# EAGLE design remote_smt (EAGLE 6.1)
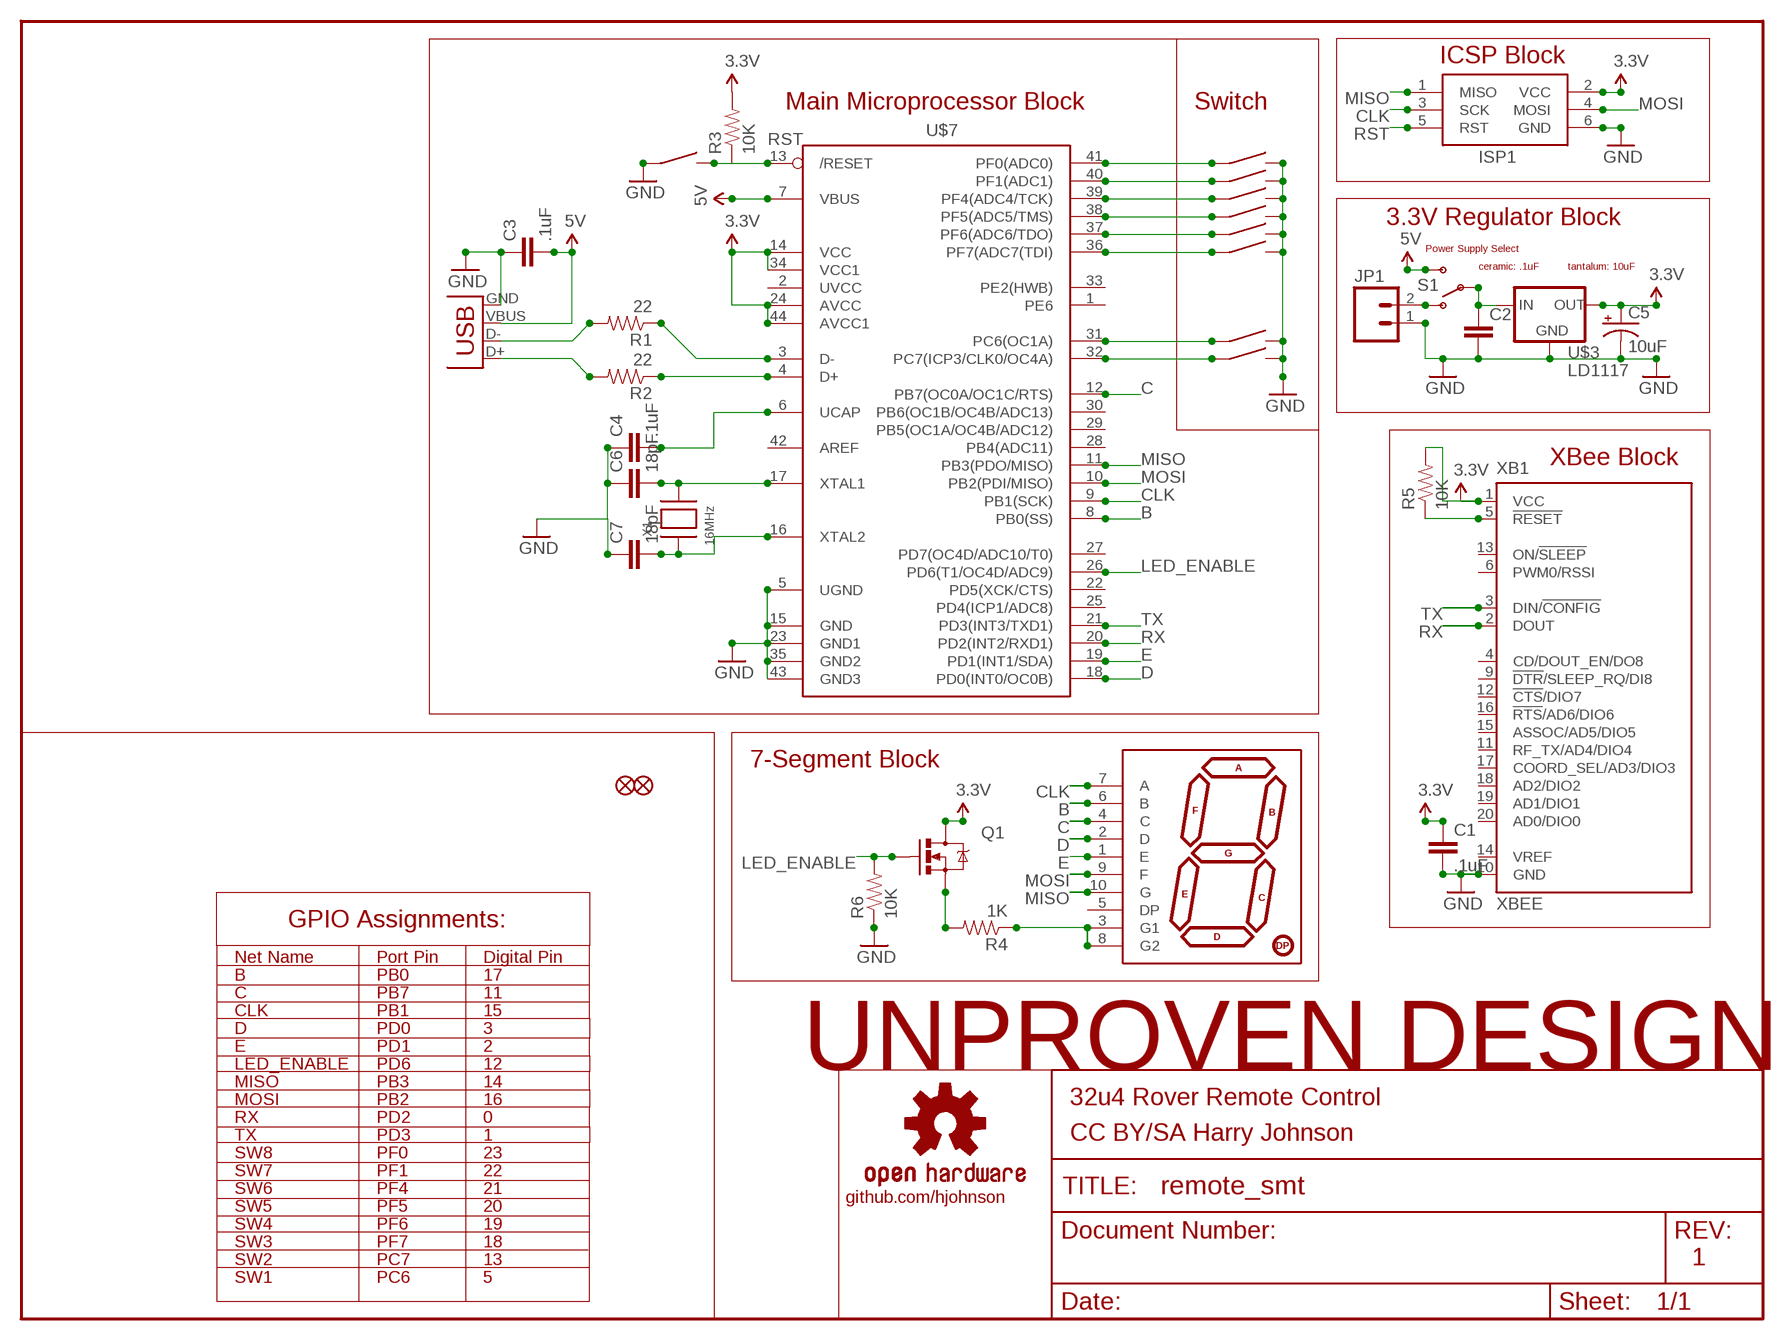
[diagram p0: schematic, sheet 1]

## Parts
C1  .1uF  CAP0805  [0805]
C2  CAP0805  [0805]
C3  .1uF  CAP0805  [0805]
C4  .1uF  CAP0805  [0805]
C5  10uF  CAP_POL3528-KIT  [EIA3528-KIT]
C6  18pF  CAP0805  [0805]
C7  18pF  CAP0805  [0805]
ISP1  AVRISP-6  [AVRISP]
JP1  M023.5MM  [SCREWTERMINAL-3.5MM-2]
JP2  FIDUCIAL1.5X3  [FIDUCIAL-1.5X3]
JP3  FIDUCIAL1.5X3  [FIDUCIAL-1.5X3]
Q1  MOSFET-NCHANNELSMD  [SOT23-3]
R1  22  RESISTOR0805-RES  [0805]
R2  22  RESISTOR0805-RES  [0805]
R3  10K  RESISTOR0805-RES  [0805]
R4  1K  RESISTOR0805-RES  [0805]
R5  10K  RESISTOR0805-RES  [0805]
R6  10K  RESISTOR0805-RES  [0805]
S1  SWITCH-SPSTKIT  [SWITCH-SPDT_KIT]
U$1  7-SEGMENT-DISPLAY-1"-RED  [7-SEGMENT-1"PTH]
U$2  SPST_SWITCH  [EG2513-ND]
U$3  LD1117  V_REG_LD1117VXXSOT223  [SOT223]
U$6  SPST_SWITCH  [EG2513-ND]
U$7  ATMEGA32U4-AU  [TQFP44]
U$8  SPST_SWITCH  [EG2513-ND]
U$10  OSHW-LOGOL  [OSHW-LOGO-L]
U$11  SPST_SWITCH  [EG2513-ND]
U$12  SPST_SWITCH  [EG2513-ND]
U$13  SPST_SWITCH  [EG2513-ND]
U$14  SPST_SWITCH  [EG2513-ND]
U$15  SPST_SWITCH  [EG2513-ND]
U$17  SPST_SWITCH  [EG2513-ND]
X1  16MHz  XTALNX5032  [NX5032]
X2  USBPTH  [USB-B-PTH]
XB1  XBEE  [XBEE]

## Nets
3.3V: C1.1 C5.A(+) ISP1.2(VCC) Q1.3(D) R3.2 R5.2 U$3.2(OUT) U$7.14(VCC) U$7.24(AVCC) U$7.34(VCC1) U$7.44(AVCC1) XB1.1(VCC)
5V: C3.2 S1.3(S) U$7.7(VBUS) X2.VBUS
B: U$1.6(B) U$7.8(PB0(SS))
C: U$1.4(C) U$7.12(PB7(OC0A/OC1C/RTS))
CLK: ISP1.3(SCK) U$1.7(A) U$7.9(PB1(SCK))
D: U$1.2(D) U$7.18(PD0(INT0/OC0B))
E: U$1.1(E) U$7.19(PD1(INT1/SDA))
GND: C1.2 C2.2 C3.1 C4.1 C5.C(-) C6.1 C7.1 ISP1.6(GND) JP1.1 R6.1 U$2.P$1 U$3.1(GND) U$3.4(GND) U$6.P$2 U$7.5(UGND) U$7.15(GND) U$7.23(GND1) U$7.35(GND2) U$7.43(GND3) U$8.P$2 U$11.P$2 U$12.P$2 U$13.P$2 U$14.P$2 U$15.P$2 U$17.P$2 X2.GND XB1.10(GND)
LED_ENABLE: Q1.1(G) R6.2 U$7.26(PD6(T1/OC4D/ADC9))
MISO: ISP1.1(MISO) U$1.10(G) U$7.11(PB3(PDO/MISO))
MOSI: ISP1.4(MOSI) U$1.9(F) U$7.10(PB2(PDI/MISO))
N$1: C6.2 U$7.17(XTAL1) X1.P$2
N$2: C7.2 U$7.16(XTAL2) X1.P$1
N$3: R1.1 U$7.3(D-)
N$4: R2.1 U$7.4(D+)
N$5: R2.2 X2.D+
N$6: R1.2 X2.D-
N$7: R4.1 U$1.3(G1) U$1.8(G2)
N$9: C4.2 U$7.6(UCAP)
N$10: Q1.2(S) R4.2
N$20: JP1.2 S1.1(O)
N$21: C2.1 S1.2(P) U$3.3(IN)
RST: ISP1.5(RST) R3.1 U$2.P$2 U$7.13(/RESET)
RX: U$7.20(PD2(INT2/RXD1)) XB1.2(DOUT)
SW1: U$6.P$1 U$7.31(PC6(OC1A))
SW2: U$7.32(PC7(ICP3/CLK0/OC4A)) U$8.P$1
SW3: U$7.36(PF7(ADC7(TDI)) U$17.P$1
SW4: U$7.37(PF6(ADC6/TDO)) U$15.P$1
SW5: U$7.38(PF5(ADC5/TMS)) U$14.P$1
SW6: U$7.39(PF4(ADC4/TCK)) U$13.P$1
SW7: U$7.40(PF1(ADC1)) U$12.P$1
SW8: U$7.41(PF0(ADC0)) U$11.P$1
TX: U$7.21(PD3(INT3/TXD1)) XB1.3(DIN/!CONFIG)
XBEE_RST: R5.1 XB1.5(!RESET)
Unconnected: U$1.5(DP) U$7.1(PE6) U$7.2(UVCC) U$7.22(PD5(XCK/CTS)) U$7.25(PD4(ICP1/ADC8)) U$7.27(PD7(OC4D/ADC10/T0)) U$7.28(PB4(ADC11)) U$7.29(PB5(OC1A/OC4B/ADC12)) U$7.30(PB6(OC1B/OC4B/ADC13)) U$7.33(PE2(HWB)) U$7.42(AREF) XB1.4(CD/DOUT_EN/DO8) XB1.6(PWM0/RSSI) XB1.9(!DTR!/SLEEP_RQ/DI8) XB1.11(RF_TX/AD4/DIO4) XB1.12(!CTS!/DIO7) XB1.13(ON/!SLEEP) XB1.14(VREF) XB1.15(ASSOC/AD5/DIO5) XB1.16(!RTS!/AD6/DIO6) XB1.17(COORD_SEL/AD3/DIO3) XB1.18(AD2/DIO2) XB1.19(AD1/DIO1) XB1.20(AD0/DIO0)

## Notes on the sheet
- ICSP Block
- Main Microprocessor Block | Switch
- 3.3V Regulator Block
- Power Supply Select
- ceramic: .1uF | tantalum: 10uF
- XBee Block
- 7-Segment Block
- GPIO Assignments:
- Net Name | Port Pin | Digital Pin
- B | PB0 | 17
- C | PB7 | 11
- CLK | PB1 | 15
- D | PD0 | 3
- E | PD1 | 2
- LED_ENABLE | PD6 | 12 | UNPROVEN DESIGN
- MISO | PB3 | 14
- MOSI | PB2 | 16 | 32u4 Rover Remote Control
- RX | PD2 | 0
- TX | PD3 | 1 | CC BY/SA Harry Johnson
- SW8 | PF0 | 23
- SW7 | PF1 | 22
- SW6 | PF4 | 21
- github.com/hjohnson
- SW5 | PF5 | 20
- SW4 | PF6 | 19
- SW3 | PF7 | 18
- SW2 | PC7 | 13 | 1
- SW1 | PC6 | 5

## Library data of the parts
C1-C4 C6 C7 = SparkFun:CAP: Capacitor Standard 0603 ceramic capacitor, and 0.1" leaded capacitor.
C5 = SparkFun:CAP_POL: Capacitor Polarized These are standard SMD and PTH capacitors. Normally 10uF, 47uF, and 100uF in electrolytic and tantalum varieties. Always verify the external diameter of the through hole cap, it varies with capacity, voltage, and manufacturer. The EIA devices should be standard.
ISP1 = adafruit:AVRISP: AVR ISP HEADER Standard 6 pin header for AVR programming
JP1 = SparkFun:M02: Header 2 Standard 2-pin 0.1" header. Use with straight break away headers (SKU : PRT-00116), right angle break away headers (PRT-00553), swiss pins (PRT-00743), machine pins (PRT-00117), and female headers (PRT-00115). Molex polarized connector foot print use with SKU : PRT-08233 with associated crimp pins and housings.
JP2 JP3 = SparkFun:FIDUCIAL: Fiducial Alignment Points Various fiducial points for machine vision alignment.
Q1 = SparkFun:MOSFET-NCHANNEL
R1-R6 = SparkFun:RESISTOR: Resistor Basic schematic elements and footprints for 0603, 1206, and PTH resistors.
S1 = SparkFun:SWITCH-SPST: SPST Switch Simple slide switch. Spark Fun Electronics SKU : COM-00102
U$1 = SparkFun:7-SEGMENT-DISPLAY-1"-RED: 7-Segment Display 1" Red (COM-08546)
U$2 U$6 U$8 U$11-U$15 U$17 = hjohnson_library:SPST_SWITCH
U$3 = hjohnson_library:V_REG_LD1117VXX: LD1117VXX voltage regulator. We carry the 3.3V version (COM-00526) in TO-220 package.
U$7 = adafruit:ATMEGA32U4: http://www.ladyada.net/library/eagle
U$10 = SparkFun:OSHW-LOGO: Open Source Hardware Logo This logo indicates the piece of hardware it is found on incorporates a OSHW license and/or adheres to the definition of open source hardware found here: http://freedomdefined.org/OSHW
X1 = adafruit:XTAL: Low cost SMT crystals, no capacitors included http://www.ladyada.net/library/eagle
X2 = hjohnson_library:USB: USB Connectors USB-B-PTH is fully proven SKU : PRT-00139 USB-miniB is fully proven SKU : PRT-00587 USB-A-PCB is untested. USB-A-H is throughly reviewed, but untested. Spark Fun Electronics SKU : PRT-00437 USB-B-SMT is throughly reviewed, but untested. Needs silkscreen touching up. USB-A-S has not been used/tested USB-MB-H has not been used/tested
XB1 = maxstream:XBEE: XBee (TM) /XBee-PRO(TM) OEM RF Modules Source: MaxStream, Inc. xbee_productmanual.pdf

## Board
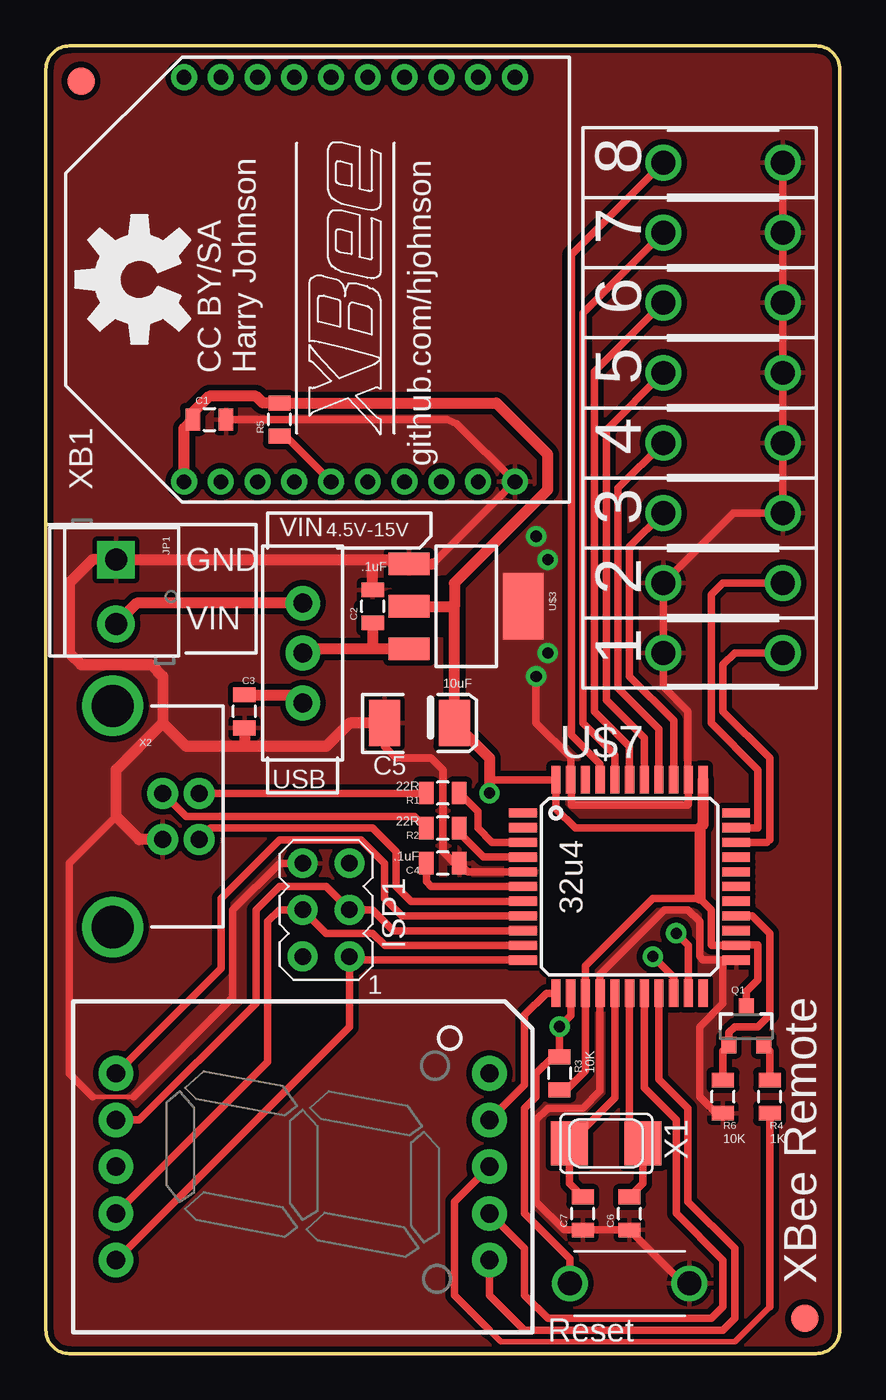
[diagram p1: board, top side]
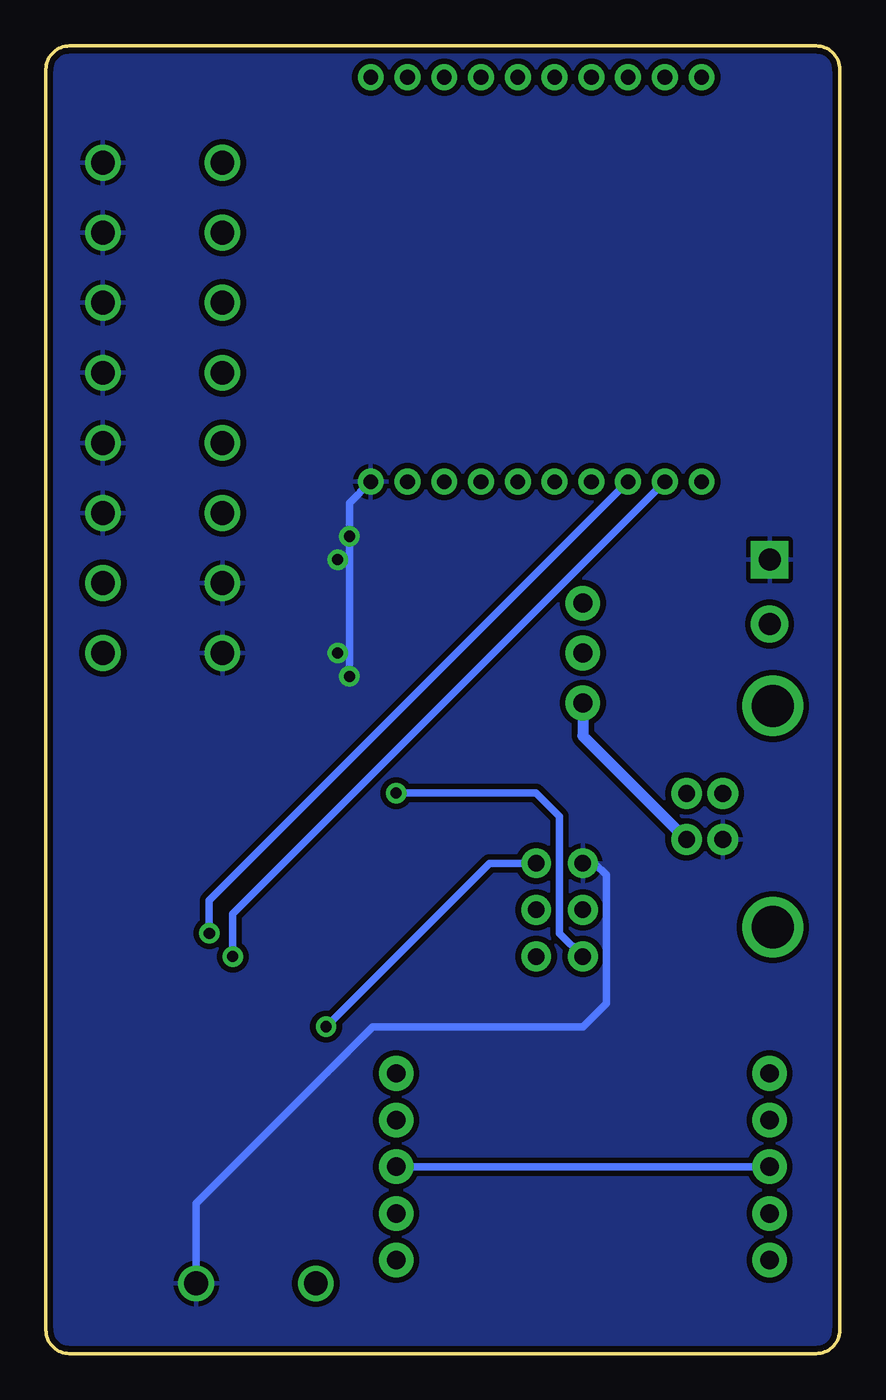
[diagram p2: board, bottom side, seen from below]

Size 43.18 x 71.12 mm. Coordinates in mm from the lower left corner, seen from the top.
Outline: 1.27,0 41.91,0 arc90 43.18,1.27 43.18,69.85 arc90 41.91,71.12 1.27,71.12 arc90 0,69.85 0,1.27 arc90 1.27,0
Copper layers (1*16): Top 0.035mm / dielectric 1.5mm / Bottom 0.035mm
Design rules: minimum track width 8mil, minimum drill 20mil, track to track 8mil, track to pad 8mil, pad to pad 8mil, via to via 8mil, smd to smd 8mil, copper to edge 10mil, drill to drill 8mil, minimum pad ring 12mil, minimum via ring 10mil, stop-mask expansion 4mil, vias tented up to drill 25mil, thermal gap 10mil
tRestrict: 4 lines

### Footprints (pad centres in the part's own frame; a part is rotated, then mirrored left to right if it is on the bottom)
0805 = smd 0.8 x 1.2: 1 -0.9,0; 2 0.9,0
EIA3528-KIT = smd 1.7 x 2.5: A 1.9,0; C -1.9,0
AVRISP = drill 0.9 pad 1.626: 1 -1.27,2.54; 2 1.27,2.54; 3 -1.27,0; 4 1.27,0; 5 -1.27,-2.54; 6 1.27,-2.54
SCREWTERMINAL-3.5MM-2 = drill 1.2 pad 2.032 square: 1 0,0 | drill 1.2 pad 2.032: 2 3.5,0
FIDUCIAL-1.5X3 = smd 1.5 x 1.5: 1 0,0
SOT23-3 = smd 0.8 x 0.9: 1 -0.95,-1; 2 0.95,-1; 3 0,1.1
SWITCH-SPDT_KIT = drill 1.016 pad 1.88: 1 0,2.718; 2 0,0; 3 0,-2.718
7-SEGMENT-1"PTH = drill 1 pad 1.88: 1 -5.08,-10.16; 2 -2.54,-10.16; 3 0,-10.16; 4 2.54,-10.16; 5 5.08,-10.16; 6 5.08,10.16; 7 2.54,10.16; 8 0,10.16; 9 -2.54,10.16; 10 -5.08,10.16
EG2513-ND = drill 1.3: P$1 -3.25,0; P$2 3.25,0
SOT223 = smd 1.219 x 2.235: 1 -2.311,-3.099; 2 0,-3.099; 3 2.311,-3.099 | smd 3.6 x 2.2: 4 0,3.099
TQFP44 = smd 1.5 x 0.5: 1 -5.8,4; 2 -5.8,3.2; 3 -5.8,2.4; 4 -5.8,1.6; 5 -5.8,0.8; 6 -5.8,0; 7 -5.8,-0.8; 8 -5.8,-1.6; 9 -5.8,-2.4; 10 -5.8,-3.2; 11 -5.8,-4; 23 5.8,-4; 24 5.8,-3.2; 25 5.8,-2.4; 26 5.8,-1.6; 27 5.8,-0.8; 28 5.8,0; 29 5.8,0.8; 30 5.8,1.6; 31 5.8,2.4; 32 5.8,3.2; 33 5.8,4 | smd 0.5 x 1.5: 12 -4,-5.8; 13 -3.2,-5.8; 14 -2.4,-5.8; 15 -1.6,-5.8; 16 -0.8,-5.8; 17 0,-5.8; 18 0.8,-5.8; 19 1.6,-5.8; 20 2.4,-5.8; 21 3.2,-5.8; 22 4,-5.8; 34 4,5.8; 35 3.2,5.8; 36 2.4,5.8; 37 1.6,5.8; 38 0.8,5.8; 39 0,5.8; 40 -0.8,5.8; 41 -1.6,5.8; 42 -2.4,5.8; 43 -3.2,5.8; 44 -4,5.8
NX5032 = smd 2 x 2.4: P$1 2,0; P$2 -2,0
USB-B-PTH = drill 0.914 pad 1.676: D+ 0,1.25; D- 1.981,1.25; GND 0,-1.25; VBUS 1.981,-1.25 | drill 2.286: S1 -2.718,-6.02; S2 -2.718,6.02
XBEE = drill 0.8 pad 1.27: 1 -11,9; 2 -11,7; 3 -11,5; 4 -11,3; 5 -11,1; 6 -11,-1; 7 -11,-3; 8 -11,-5; 9 -11,-7; 10 -11,-9; 11 11,-9; 12 11,-7; 13 11,-5; 14 11,-3; 15 11,-1; 16 11,1; 17 11,3; 18 11,5; 19 11,7; 20 11,9

### Placement (x,y rotation side)
C1  8.89,50.8 0 top
C2  17.78,40.64 90 top
C3  10.79,34.92 90 top
C4  21.59,26.67 180 top
C5  20.32,34.29 0 top
C6  31.75,7.62 90 top
C7  29.21,7.62 90 top
ISP1  15.24,24.13 180 top
JP1  3.81,43.18 270 top
JP2  1.91,69.22 0 top
JP3  41.27,1.91 0 top
Q1  38.1,17.78 0 top
R1  21.59,30.48 180 top
R2  21.59,28.57 180 top
R3  27.94,15.24 270 top
R4  39.37,13.97 90 top
R5  12.7,50.8 90 top
R6  36.83,13.97 90 top
S1  13.97,38.1 0 top
U$1  13.97,10.16 90 top
U$2  31.75,3.81 180 top
U$3  22.86,40.64 270 top
U$6  36.83,38.1 180 top
U$7  31.75,25.4 0 top
U$8  36.83,41.91 180 top
U$10  5.08,58.42 90 top
U$11  36.83,64.77 0 top
U$12  36.83,60.96 0 top
U$13  36.83,57.15 0 top
U$14  36.83,53.34 0 top
U$15  36.83,49.53 0 top
U$17  36.83,45.72 0 top
X1  30.48,11.43 180 top
X2  6.35,29.21 0 top
XB1  16.51,58.42 90 top

### Tracks (layer width: path | path; a pad name or v marks a point on that pad's centre or on a via)
3.3V  (via drill 0.6)
  Top 0.406: R3.2 28.31,14.34 29.35,15.38 U$7.14 29.35,21.09 33.02,24.77 35.56,24.77 36.2,24.13 36.2,22.23 36.22,22.2 U$7.24 37.55,22.23 38.73,22.23 38.73,20.32 38.1,19.68 Q1.3 | 35.56,28.57 28.79,28.57 27.75,29.62 U$7.44 24.13,31.2 v24.13,30.48
  Top 0.61: XB1.1 7.51,50.32 C1.1 7.99,51.17 8.89,52.07 11.43,52.07 11.8,51.7 R5.2 24.5,51.7 27.3,48.9 27.3,46.99 22.22,41.91 22.22,40.64 | U$3.2 22.22,40.64 | U$7.34 35.75,28.77 35.56,28.57 35.56,24.77 | v24.13,30.48 24.13,32.38 C5.A 22.22,40.64
  Bottom 0.406: v24.13,30.48 16.51,30.48 15.24,29.21 15.24,22.86 ISP1.2
5V
  Top 0.406: X2.VBUS 8.95,28.57 17.78,28.57 19.05,27.3 19.05,25.4 19.85,24.6 U$7.7
  Top 0.61: C3.2 13.71,35.83 13.97,35.56 S1.3
  Bottom 0.61: S1.3 13.97,33.6 X2.VBUS
B
  Top 0.406: U$1.6 9.53,20.95 9.53,24.77 12.7,27.94 17.14,27.94 18.41,26.67 18.41,24.77 19.38,23.8 U$7.8
C
  Top 0.406: U$1.4 26.04,14.61 26.04,18.41 27.22,19.6 U$7.12
CLK
  Top 0.406: U$7.9 18.91,23 17.78,24.13 ISP1.3 15.24,25.4 12.7,25.4 11.43,24.13 11.43,19.05 5.08,12.7 U$1.7
D
  Top 0.406: U$1.2 26.04,5.71 26.04,3.17 27.3,1.91 36.2,1.91 36.83,2.54 36.83,5.08 34.29,7.62 34.29,12.7 32.55,14.44 U$7.18
E
  Top 0.406: U$7.19 33.35,14.91 34.92,13.34 34.92,8.26 37.47,5.71 37.47,1.91 36.83,1.27 26.04,1.27 24.13,3.17 U$1.1
GND  (via drill 0.6)
  Top 0.254: 4.77,13.97 2.54,13.97
  Top 0.406: U$11.P$2 U$12.P$2 U$13.P$2 U$14.P$2 U$15.P$2 U$17.P$2 37.39,45.72 U$8.P$2 U$6.P$2 33.58,36.27 34.92,34.92 34.92,31.23 U$7.35 34.95,29.87 34.92,29.84 28.57,29.84 28.57,31.18 U$7.43 28.55,32.41 26.67,34.29 v26.67,36.83 | 19.53,43.18 U$3.1 | 21.04,42.95 XB1.10 22.34,50.59 21.83,50.8 C1.2 | 36.83,21.4 35.75,21.4 35.56,21.59 35.56,23.5 34.92,24.13 33.66,24.13 30.15,20.62 U$7.15 30.15,14.28 29.21,13.34 27.3,13.34 26.67,12.7 26.67,8.26 28.2,6.72 C7.1 C6.1 34.66,3.81 U$2.P$1 | 36.83,21.4 U$7.23 | U$7.5 22.96,26.2 C4.1 22.23,26.67 21.59,27.3 21.59,31.75 20.95,32.38 19.05,32.38 18.41,33.02 C5.C | ISP1.6 12.7,26.67 10.16,24.13 10.16,19.36 4.77,13.97 | 2.54,13.97 1.27,15.24 1.27,26.67 3.81,29.21 | R6.1 36.46,13.07 35.56,13.97 35.56,17.78 36.83,19.05 36.83,21.4
  Top 0.61: U$3.1 21.04,42.95 | 17.78,43.18 JP1.1 2.54,43.18 1.27,41.91 1.27,38.1 1.91,37.47 5.71,37.47 6.35,36.83 6.35,34.29 | 17.78,43.18 19.53,43.18 | C2.2 17.78,43.18 | X2.GND 5.06,27.96 3.81,29.21 3.81,31.75 6.35,34.29 | C5.C 16.51,34.29 15.24,33.02 10.79,33.02 | 10.79,33.02 7.62,33.02 6.35,34.29 | C3.1 10.79,33.02
  Bottom 0.406: ISP1.6 13.34,26.67 12.7,26.04 12.7,19.05 13.97,17.78 25.4,17.78 35,8.18 U$2.P$1 | XB1.10 26.67,46.26 v26.67,44.45 v26.67,36.83
  other vias: 27.3,43.18 27.3,38.1
  pour Bottom (isolate 0.305): 0,0 43.18,0 43.18,71.12 0,71.12
  pour Top (isolate 0.305): 0,0 43.18,0 43.18,71.12 0,71.12
  pour Top (isolate 0.305, no thermals): 28.57,36.2 28.57,45.09 24.77,45.09 23.5,43.81 23.5,37.47 25.4,35.56 28.57,35.56
LED_ENABLE
  Top 0.406: U$7.26 38.43,23.8 39.37,22.86 39.37,18.41 38.73,17.78 37.47,17.78 37.15,17.46 Q1.1 36.83,16.46 R6.2
MISO
  Top 0.406: U$7.11 16.7,21.4 ISP1.1 16.51,17.78 U$1.10
MOSI
  Top 0.406: U$7.10 18.44,22.2 17.78,22.86 15.24,22.86 ISP1.4 12.7,24.13 12.06,23.5 12.06,15.88 U$1.9
N$1
  Top 0.406: C6.2 32.48,9.25 X1.P$2 31.75,12.16 U$7.17
N$2
  Top 0.406: C7.2 28.48,9.25 X1.P$1 30.95,13.9 U$7.16
N$3
  Top 0.406: U$7.3 24.27,27.8 23.5,28.57 23.5,29.48 R1.1
N$4
  Top 0.406: U$7.4 23.8,27 22.49,28.31 R2.1
N$5
  Top 0.406: X2.D+ 6.37,30.46 7.62,29.21 20.05,29.21 R2.2
N$6
  Top 0.406: X2.D- 20.69,30.46 R1.2
N$7
  Top 0.305: 24.13,1.27 24.77,0.64 37.47,0.64 39.37,2.54
  Top 0.406: U$1.3 22.23,8.26 22.23,3.17 24.13,1.27 | R4.1 39.37,2.54
  Bottom 0.406: U$1.8 U$1.3
N$9
  Top 0.406: U$7.6 20.95,25.4 20.69,25.66 C4.2
N$10
  Top 0.406: R4.2 39.37,16.46 Q1.2
N$20
  Top 0.61: S1.1 4.95,40.82 JP1.2
N$21
  Top 0.61: U$3.3 17.78,38.33 | 17.78,38.33 14.2,38.33 S1.2 | C2.1 17.78,38.33
RST  (via drill 0.6)
  Top 0.406: U$7.13 28.55,18.39 v27.94,17.78 R3.1 27.57,16.14 26.67,15.24 26.67,13.97 26.04,13.34 26.04,7.62 28.5,5.16 U$2.P$2
  Bottom 0.406: ISP1.5 19.05,26.67 v27.94,17.78
RX  (via drill 0.6)
  Top 0.406: U$7.20 34.15,20.46 v33.02,21.59
  Bottom 0.406: XB1.2 33.02,23.91 v33.02,21.59
SW1
  Top 0.406: U$7.31 39.23,27.8 39.37,27.94 39.37,32.38 36.83,34.92 36.83,37.47 37.47,38.1 U$6.P$1
SW2
  Top 0.406: U$8.P$1 36.83,41.91 36.2,41.27 36.2,34.29 38.73,31.75 38.73,28.6 U$7.32
SW3
  Top 0.406: U$7.36 34.15,34.43 31.75,36.83 31.75,43.89 U$17.P$1
SW4
  Top 0.406: U$7.37 33.35,33.96 31.11,36.2 31.11,47.06 U$15.P$1
SW5
  Top 0.406: U$7.38 32.55,33.49 30.48,35.56 30.48,50.24 U$14.P$1
SW6
  Top 0.406: U$7.39 31.75,33.02 29.84,34.92 29.84,53.41 U$13.P$1
SW7
  Top 0.406: U$7.40 30.95,32.55 29.21,34.29 29.21,56.59 U$12.P$1
SW8
  Top 0.406: U$7.41 30.15,32.08 28.57,33.66 28.57,59.77 U$11.P$1
TX  (via drill 0.6)
  Top 0.406: U$7.21 34.95,22.2 v34.29,22.86
  Bottom 0.406: v34.29,22.86 34.29,24.64 XB1.3
XBEE_RST
  Top 0.406: R5.1 13.03,49.9 XB1.5

### Text on the board
tPlace: 8 | 7 | 6 | CC BY/SA | Harry Johnson | 5 | 4 | github.com/hjohnson | 3 | VIN | 4.5V-15V | GND | .1uF | 2 | VIN | 1 | 10uF | USB | 22R | 22R | 32u4 | .1uF | 10K | 10K | 1K | XBee Remote | Reset
Reference: UNPROVEN DESIGN